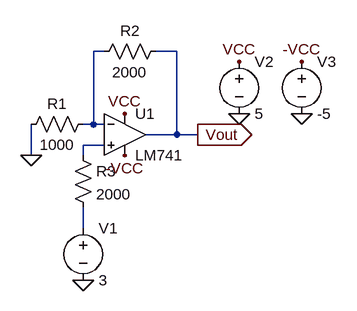
[diagram p0: schematic lab4_task2_part2_3.asc]
lab4_task2_part2_3.asc, the LTspice schematic file:
Version 4.1
SHEET 1 880 680
WIRE 112 48 96 48
WIRE 224 48 192 48
WIRE 96 160 96 48
WIRE 96 160 80 160
WIRE 112 160 96 160
WIRE 224 176 224 48
WIRE 224 176 176 176
WIRE 256 176 224 176
WIRE 112 192 80 192
WIRE 0 208 0 160
WIRE 80 208 80 192
WIRE 80 320 80 288
FLAG 80 400 0
FLAG 320 144 0
FLAG 416 144 0
FLAG 320 64 VCC
FLAG 144 144 VCC
FLAG 416 64 -VCC
FLAG 144 208 -VCC
FLAG 256 176 Vout
IOPIN 256 176 Out
FLAG 0 208 0
SYMBOL res 96 144 R90
WINDOW 0 0 56 VBottom 2
WINDOW 3 32 56 VTop 2
SYMATTR InstName R1
SYMATTR Value 1000
SYMBOL res 208 32 R90
WINDOW 0 0 56 VBottom 2
WINDOW 3 32 56 VTop 2
SYMATTR InstName R2
SYMATTR Value 2000
SYMBOL voltage 80 304 R0
WINDOW 123 0 0 Left 0
WINDOW 39 0 0 Left 0
SYMATTR InstName V1
SYMATTR Value 3
SYMBOL voltage 320 48 R0
WINDOW 123 0 0 Left 0
WINDOW 39 0 0 Left 0
SYMATTR InstName V2
SYMATTR Value 5
SYMBOL voltage 416 48 R0
WINDOW 123 0 0 Left 0
WINDOW 39 0 0 Left 0
SYMATTR InstName V3
SYMATTR Value -5
SYMBOL LM741 144 112 R0
SYMATTR InstName U1
SYMBOL res 64 192 R0
SYMATTR InstName R3
SYMATTR Value 2000

The netlist it stands for:
* lab4_task2_part2_3.asc
R1 N001 0 1000
R2 Vout N001 2000
V1 N003 0 3
V2 VCC 0 5
V3 -VCC 0 -5
X§U1 N002 N001 VCC -VCC Vout LM741  ; pins In+ In- V+ V- OUT
R3 N002 N003 2000
.lib LM741.lib
.backanno
.end